# Altium project final_design.PrjPcb
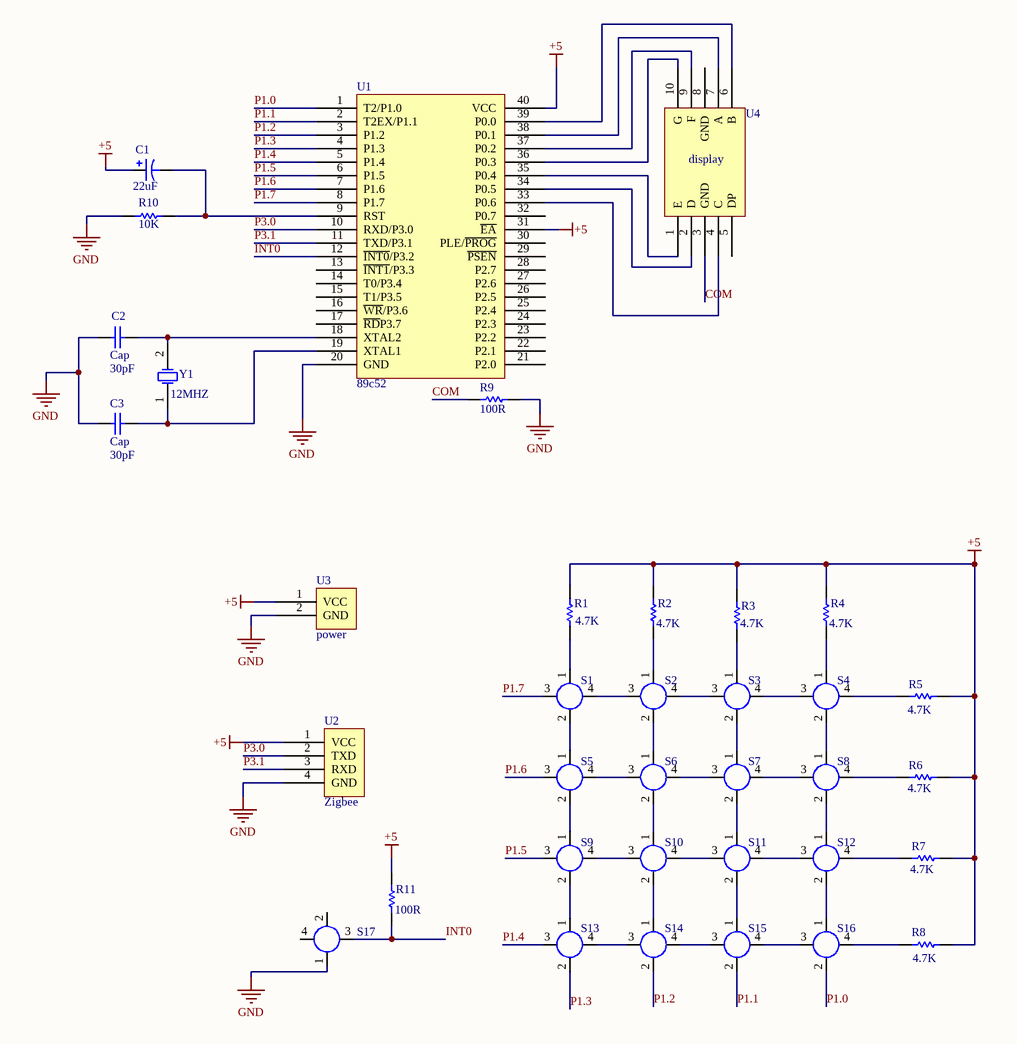
[diagram p0: final_design.SchDoc]
1 sheet, 36 parts. Net scope: global (net labels, ports and power ports of the same name join across sheets).
Board file: final_design.PcbDoc

## Sheet final_design.SchDoc
size A3

### Parts
C1  value 22uF  [RB]  (hidden comment: Cap Pol1)
C2  Cap  value 30pF  [MLCC]
C3  Cap  value 30pF  [MLCC]
R1  value 4.7K  [Ris]  (hidden comment: Res1)
R2  value 4.7K  [Ris]  (hidden comment: Res1)
R3  value 4.7K  [Ris]  (hidden comment: Res1)
R4  value 4.7K  [Ris]  (hidden comment: Res1)
R5  value 4.7K  [Ris]  (hidden comment: Res1)
R6  value 4.7K  [Ris]  (hidden comment: Res1)
R7  value 4.7K  [Ris]  (hidden comment: Res1)
R8  value 4.7K  [Ris]  (hidden comment: Res1)
R9  value 100R  [Ris]  (hidden comment: Res1)
R10  value 10K  [Ris]  (hidden comment: Res1)
R11  value 100R  [Ris]  (hidden comment: Res1)
S1  Button-4feet  [Button-4feet]  (value not drawn)
S2  Button-4feet  [Button-4feet]  (value not drawn)
S3  Button-4feet  [Button-4feet]  (value not drawn)
S4  Button-4feet  [Button-4feet]  (value not drawn)
S5  Button-4feet  [Button-4feet]  (value not drawn)
S6  Button-4feet  [Button-4feet]  (value not drawn)
S7  Button-4feet  [Button-4feet]  (value not drawn)
S8  Button-4feet  [Button-4feet]  (value not drawn)
S9  Button-4feet  [Button-4feet]  (value not drawn)
S10  Button-4feet  [Button-4feet]  (value not drawn)
S11  Button-4feet  [Button-4feet]  (value not drawn)
S12  Button-4feet  [Button-4feet]  (value not drawn)
S13  Button-4feet  [Button-4feet]  (value not drawn)
S14  Button-4feet  [Button-4feet]  (value not drawn)
S15  Button-4feet  [Button-4feet]  (value not drawn)
S16  Button-4feet  [Button-4feet]  (value not drawn)
S17  Button-4feet  [Button-4feet]  (value not drawn)
U1  89c52  [89C52]
U2  Zigbee  [Zigbee]
U3  power  [Power]
U4  display  [Dsplay]
Y1  12MHZ  [Oscillator-11.0592MHZ]

### Nets
+5: C1.1 R1.2 R2.1 R3.2 R4.2 R5.1 R6.1 R7.1 R8.1 R11.2 U1.31(~{EA}) U1.40(VCC) U2.1(VCC) U3.1(VCC)
GND: C2.1 C3.1 R9.1 R10.2 S17.1 U1.20(GND) U2.4(GND) U3.2(GND)
COM: R9.2 U4.3(GND)
INT0: R11.1 S17.3 U1.12(~{INT0}/P3.2)
P1.0: S16.2 U1.1(T2/P1.0)
P1.1: S15.2 U1.2(T2EX/P1.1)
P1.2: S14.2 U1.3(P1.2)
P1.3: S13.2 U1.4(P1.3)
P1.4: S13.3 U1.5(P1.4)
P1.5: S9.3 U1.6(P1.5)
P1.6: S5.3 U1.7(P1.6)
P1.7: S1.3 U1.8(P1.7)
P3.0: U1.10(RXD/P3.0) U2.2(TXD)
P3.1: U1.11(TXD/P3.1) U2.3(RXD)
NetC1_2: C1.2 R10.1 U1.9(RST)
NetC2_2: C2.2 U1.18(XTAL2) Y1.2(OSC2)
NetC3_2: C3.2 U1.19(XTAL1) Y1.1(OSC1)
NetR1_1: R1.1 S1.1
NetR2_2: R2.2 S2.1
NetR3_1: R3.1 S3.1
NetR4_1: R4.1 S4.1
NetR5_2: R5.2 S4.4
NetR6_2: R6.2 S8.4
NetR7_2: R7.2 S12.4
NetR8_2: R8.2 S16.4
NetS1_2: S1.2 S5.1
NetS1_4: S1.4 S2.3
NetS2_2: S2.2 S6.1
NetS2_4: S2.4 S3.3
NetS3_2: S3.2 S7.1
NetS3_4: S3.4 S4.3
NetS4_2: S4.2 S8.1
NetS5_2: S5.2 S9.1
NetS5_4: S5.4 S6.3
NetS6_2: S6.2 S10.1
NetS6_4: S6.4 S7.3
NetS7_2: S7.2 S11.1
NetS7_4: S7.4 S8.3
NetS8_2: S8.2 S12.1
NetS9_2: S9.2 S13.1
NetS9_4: S9.4 S10.3
NetS10_2: S10.2 S14.1
NetS10_4: S10.4 S11.3
NetS11_2: S11.2 S15.1
NetS11_4: S11.4 S12.3
NetS12_2: S12.2 S16.1
NetS13_4: S13.4 S14.3
NetS14_4: S14.4 S15.3
NetS15_4: S15.4 S16.3
NetU1_33: U1.33(P0.6) U4.4(C)
NetU1_34: U1.34(P0.5) U4.2(D)
NetU1_35: U1.35(P0.4) U4.1(E)
NetU1_36: U1.36(P0.3) U4.10(G)
NetU1_37: U1.37(P0.2) U4.9(F)
NetU1_38: U1.38(P0.1) U4.7(A)
NetU1_39: U1.39(P0.0) U4.6(B)

Not connected (* = marked no-connect by the designer): S17 2 4; U1 13(~{INT1}/P3.3) 14(T0/P3.4) 15(T1/P3.5) 16(~{WR}/P3.6) 17(~{RD}P3.7) 21(P2.0) 22(P2.1) 23(P2.2) 24(P2.3) 25(P2.4) 26(P2.5) 27(P2.6) 28(P2.7) 29(~{PSEN}) 30(PLE/~{PROG}) 32(P0.7); U4 5(DP) 8(GND)

### Library data of the parts
C1 = Cap Pol1: Polarized Capacitor (Radial); Published: 8-Jun-2000; LatestRevisionDate: 17-Jul-2002; LatestRevisionNote: Re-released for DXP Platform.; PackageReference: RB7.6-15; Publisher: Altium Limited; PackageDescription: Polarized Capacitor (Radial); 2 Leads
C2 C3 = Cap: Capacitor; Published: 8-Jun-2000; LatestRevisionDate: 17-Jul-2002; LatestRevisionNote: Re-released for DXP Platform.; PackageReference: RAD-0.3; Publisher: Altium Limited; PackageDescription: Radial Cap, Thru-Hole; 2 Leads; 0.3 in Pin Spacing
R1-R11 = Res1: Resistor; Published: 8-Jun-2000; LatestRevisionDate: 17-Jul-2002; LatestRevisionNote: Re-released for DXP Platform.; PackageReference: AXIAL-0.3; Publisher: Altium Limited; PackageDescription: Axial Device, Thru-Hole; 2 Leads; 0.3 in Pin Spacing
Y1 = XTAL: Crystal Oscillator; Published: 8-Jun-2000; LatestRevisionDate: 17-Jul-2002; LatestRevisionNote: Re-released for DXP Platform.; PackageReference: R38; Publisher: Altium Limited; PackageDescription: Crystal, Thru-Hole; 2 Leads; Body 3.1 x 8.2 mm (Dia.xH)